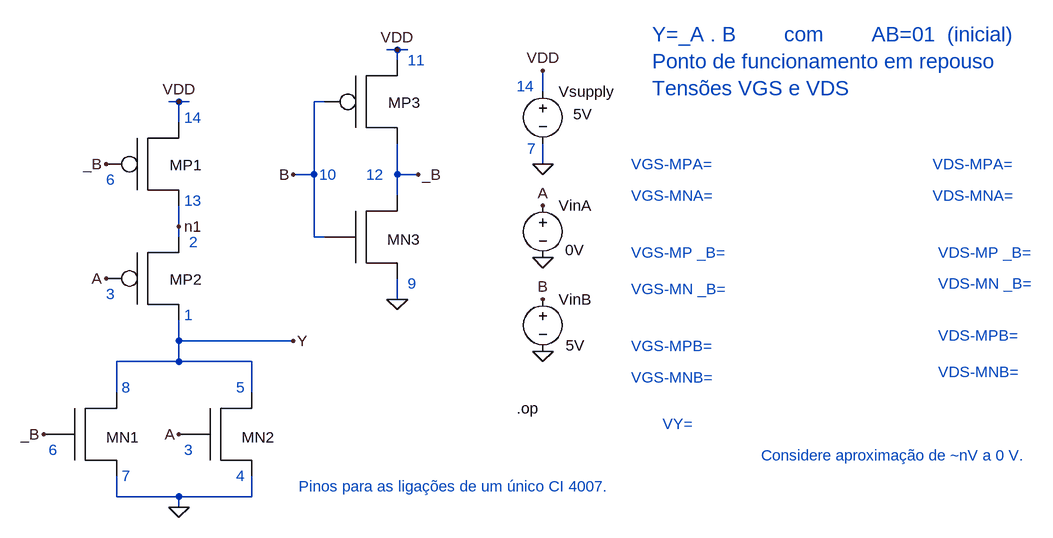
[diagram p0: schematic static-gate-DCoppnt.asc]
static-gate-DCoppnt.asc, the LTspice schematic file:
Version 4
SHEET 1 2472 772
WIRE -416 -32 -432 -32
WIRE -400 -32 -416 -32
WIRE -416 -16 -416 -32
WIRE -192 32 -192 0
WIRE -752 48 -768 48
WIRE -736 48 -752 48
WIRE -528 48 -544 48
WIRE -752 80 -752 48
WIRE -192 144 -192 112
WIRE -544 160 -544 48
WIRE -544 160 -576 160
WIRE -416 160 -416 112
WIRE -384 160 -416 160
WIRE -416 192 -416 160
WIRE -752 240 -752 208
WIRE -752 256 -752 240
WIRE -544 256 -544 160
WIRE -528 256 -544 256
WIRE -416 352 -416 320
WIRE -752 416 -752 384
WIRE -576 416 -752 416
WIRE -752 448 -752 416
WIRE -752 448 -848 448
WIRE -640 448 -752 448
WIRE -848 496 -848 448
WIRE -640 496 -640 448
WIRE -848 656 -848 624
WIRE -752 656 -848 656
WIRE -640 656 -640 624
WIRE -640 656 -752 656
WIRE -752 672 -752 656
FLAG -416 -32 VDD
FLAG -576 160 B
FLAG -384 160 _B
FLAG -752 48 VDD
FLAG -864 144 _B
FLAG -960 560 _B
FLAG -864 320 A
FLAG -752 560 A
FLAG -192 144 0
FLAG -192 288 0
FLAG -192 432 0
FLAG -192 0 VDD
FLAG -192 208 A
FLAG -192 352 B
FLAG -576 416 Y
FLAG -752 240 n1
FLAG -416 352 0
FLAG -752 672 0
DATAFLAG 256 160 "V(a)-V(n1)"
DATAFLAG 256 208 "V(a)"
DATAFLAG 256 352 "V(_b)"
DATAFLAG 256 288 "V(_b)-V(vdd)"
DATAFLAG 256 480 "V(b)"
DATAFLAG 256 432 "V(b)-V(vdd)"
DATAFLAG 720 160 "V(y)-V(n1)"
DATAFLAG 720 208 "V(y)"
DATAFLAG 720 352 "V(y)"
DATAFLAG 720 288 "V(n1)-V(vdd)"
DATAFLAG 720 480 "V(_b)"
DATAFLAG 720 432 "V(_b)-V(vdd)"
DATAFLAG 176 560 "V(y)"
SYMBOL voltage -192 16 R0
WINDOW 3 47 51 Left 2
SYMATTR Value 5V
SYMATTR InstName Vsupply
SYMBOL voltage -192 192 R0
WINDOW 123 0 0 Left 2
WINDOW 39 0 0 Left 2
WINDOW 3 34 84 Left 2
SYMATTR Value 0V
SYMATTR InstName VinA
SYMBOL voltage -192 336 R0
WINDOW 123 0 0 Left 2
WINDOW 39 0 0 Left 2
WINDOW 3 35 87 Left 2
SYMATTR Value 5V
SYMATTR InstName VinB
SYMBOL PMOSX -784 128 R0
SYMATTR InstName MP1
SYMBOL PMOSX -784 304 R0
SYMATTR InstName MP2
SYMBOL PMOSX -448 32 R0
SYMATTR InstName MP3
SYMBOL NMOSX -880 544 R0
SYMATTR InstName MN1
SYMBOL NMOSX -672 544 R0
SYMATTR InstName MN2
SYMBOL NMOSX -448 240 R0
SYMATTR InstName MN3
TEXT -864 168 Left 2 ;6
TEXT -952 584 Left 2 ;6
TEXT -864 344 Left 2 ;3
TEXT -744 584 Left 2 ;3
TEXT -744 72 Left 2 ;14
TEXT -744 200 Left 2 ;13
TEXT -840 488 Left 2 ;8
TEXT -840 624 Left 2 ;7
TEXT -664 488 Left 2 ;5
TEXT -664 624 Left 2 ;4
TEXT -736 264 Left 2 ;2
TEXT -744 376 Left 2 ;1
TEXT -536 160 Left 2 ;10
TEXT -400 -16 Left 2 ;11
TEXT -464 160 Left 2 ;12
TEXT -400 328 Left 2 ;9
TEXT -232 24 Left 2 ;14
TEXT -216 120 Left 2 ;7
TEXT -24 -56 Left 3 ;Y=_A . B        com        AB=01  (inicial)\nPonto de funcionamento em repouso\nTensões VGS e VDS
TEXT -56 144 Left 2 ;VGS-MPA=
TEXT -56 192 Left 2 ;VGS-MNA=
TEXT -56 336 Left 2 ;VGS-MN _B=
TEXT -56 280 Left 2 ;VGS-MP _B=
TEXT -56 472 Left 2 ;VGS-MNB=
TEXT -56 424 Left 2 ;VGS-MPB=
TEXT 408 144 Left 2 ;VDS-MPA=
TEXT 408 192 Left 2 ;VDS-MNA=
TEXT 416 328 Left 2 ;VDS-MN _B=
TEXT 416 280 Left 2 ;VDS-MP _B=
TEXT 416 464 Left 2 ;VDS-MNB=
TEXT 416 408 Left 2 ;VDS-MPB=
TEXT -8 544 Left 2 ;VY=
TEXT 144 592 Left 2 ;Considere aproximação de ~nV a 0 V.
TEXT -232 520 Left 2 !.op
TEXT -568 640 Left 2 ;Pinos para as ligações de um único CI 4007.

The netlist it stands for:
* static-gate-DCoppnt.asc
Vsupply VDD 0 5V
VinA A 0 0V
VinB B 0 5V
XMP1 n1 _B VDD PMOSX  ; pins D G S
XMP2 Y A n1 PMOSX  ; pins D G S
XMP3 _B B VDD PMOSX  ; pins D G S
XMN1 Y _B 0 NMOSX  ; pins D G S
XMN2 Y A 0 NMOSX  ; pins D G S
XMN3 _B B 0 NMOSX  ; pins D G S
* 6
* 6
* 3
* 3
* 14
* 13
* 8
* 7
* 5
* 4
* 2
* 1
* 10
* 11
* 12
* 9
* 14
* 7
* Y=_A . B        com        AB=01  (inicial)
* Ponto de funcionamento em repouso
* Tensões VGS e VDS
* VGS-MPA=
* VGS-MNA=
* VGS-MN _B=
* VGS-MP _B=
* VGS-MNB=
* VGS-MPB=
* VDS-MPA=
* VDS-MNA=
* VDS-MN _B=
* VDS-MP _B=
* VDS-MNB=
* VDS-MPB=
* VY=
* Considere aproximação de ~nV a 0 V.
.op
* Pinos para as ligações de um único CI 4007.
.lib MOS4007.txt
.backanno
.end

* Results of the author's LTspice run, read from the files saved beside the schematic
* Operating Point:
*   V(vdd) = 5 V
*   V(a) = 0 V
*   V(b) = 5 V
*   V(n1) = 5 V
*   V(_b) = 3.177 nV
*   V(y) = 5 V
*   I(Vinb) = 0 A
*   I(Vina) = 0 A
*   I(Vsupply) = -30.03 pA
* From the log:
*   Semiconductor Device Operating Points:
*                           --- MOSFET Transistors ---
*   Name:        m:mn3:1      m:mn2:1      m:mn1:1      m:mp3:1      m:mp2:1
*   Model:     mn3:hef4007n mn2:hef4007n mn1:hef4007n mp3:hef4007p mp2:hef4007p
*   Id:          1.00e-11     1.00e-11     1.00e-11    -1.00e-11     1.41e-10
*   Vgs:         5.00e+00     0.00e+00     3.18e-09     0.00e+00    -5.00e+00
*   Vds:         3.18e-09     5.00e+00     5.00e+00    -5.00e+00     1.38e-07
*   Vbs:         0.00e+00     0.00e+00     0.00e+00     0.00e+00     1.72e-08
*   Vth:         1.42e+00     1.42e+00     1.42e+00    -1.60e+00    -1.60e+00
*   Vdsat:       3.58e+00     0.00e+00     0.00e+00    -0.00e+00    -3.40e+00
*   Gm:          2.80e-12     0.00e+00     0.00e+00     0.00e+00     4.15e-11
*   Gds:         3.15e-03     0.00e+00     0.00e+00     0.00e+00     1.02e-03
*   Gmb:         3.61e-12     0.00e+00     0.00e+00     0.00e+00     2.68e-11
*   Cbd:         2.00e-13     4.53e-14     4.53e-14     4.53e-14     2.00e-13
*   Cbs:         2.00e-13     2.00e-13     2.00e-13     2.00e-13     2.00e-13
*   Cgsov:       0.00e+00     0.00e+00     0.00e+00     0.00e+00     0.00e+00
*   Cgdov:       0.00e+00     0.00e+00     0.00e+00     0.00e+00     0.00e+00
*   Cgbov:       0.00e+00     0.00e+00     0.00e+00     0.00e+00     0.00e+00
*   Cgs:         1.23e-13     0.00e+00     0.00e+00     1.62e-13     1.22e-13
*   Cgd:         1.23e-13     0.00e+00     0.00e+00     0.00e+00     1.22e-13
*   Cgb:         0.00e+00     2.47e-13     2.47e-13     0.00e+00     0.00e+00
*   Name:        m:mp1:1
*   Model:     mp1:hef4007p
*   Id:         -1.75e-11
*   Vgs:        -5.00e+00
*   Vds:        -1.72e-08
*   Vbs:         0.00e+00
*   Vth:        -1.60e+00
*   Vdsat:      -3.40e+00
*   Gm:          5.15e-12
*   Gds:         1.02e-03
*   Gmb:         3.32e-12
*   Cbd:         2.00e-13
*   Cbs:         2.00e-13
*   Cgsov:       0.00e+00
*   Cgdov:       0.00e+00
*   Cgbov:       0.00e+00
*   Cgs:         1.22e-13
*   Cgd:         1.22e-13
*   Cgb:         0.00e+00